# Altium schematic sheet BI2.SchDoc
size 420 x 297 mm; DocumentNumber: 7; SheetNumber: 7; SheetTotal: 13; DecimalNumber: СНАБ.468222.001 ЭЗ
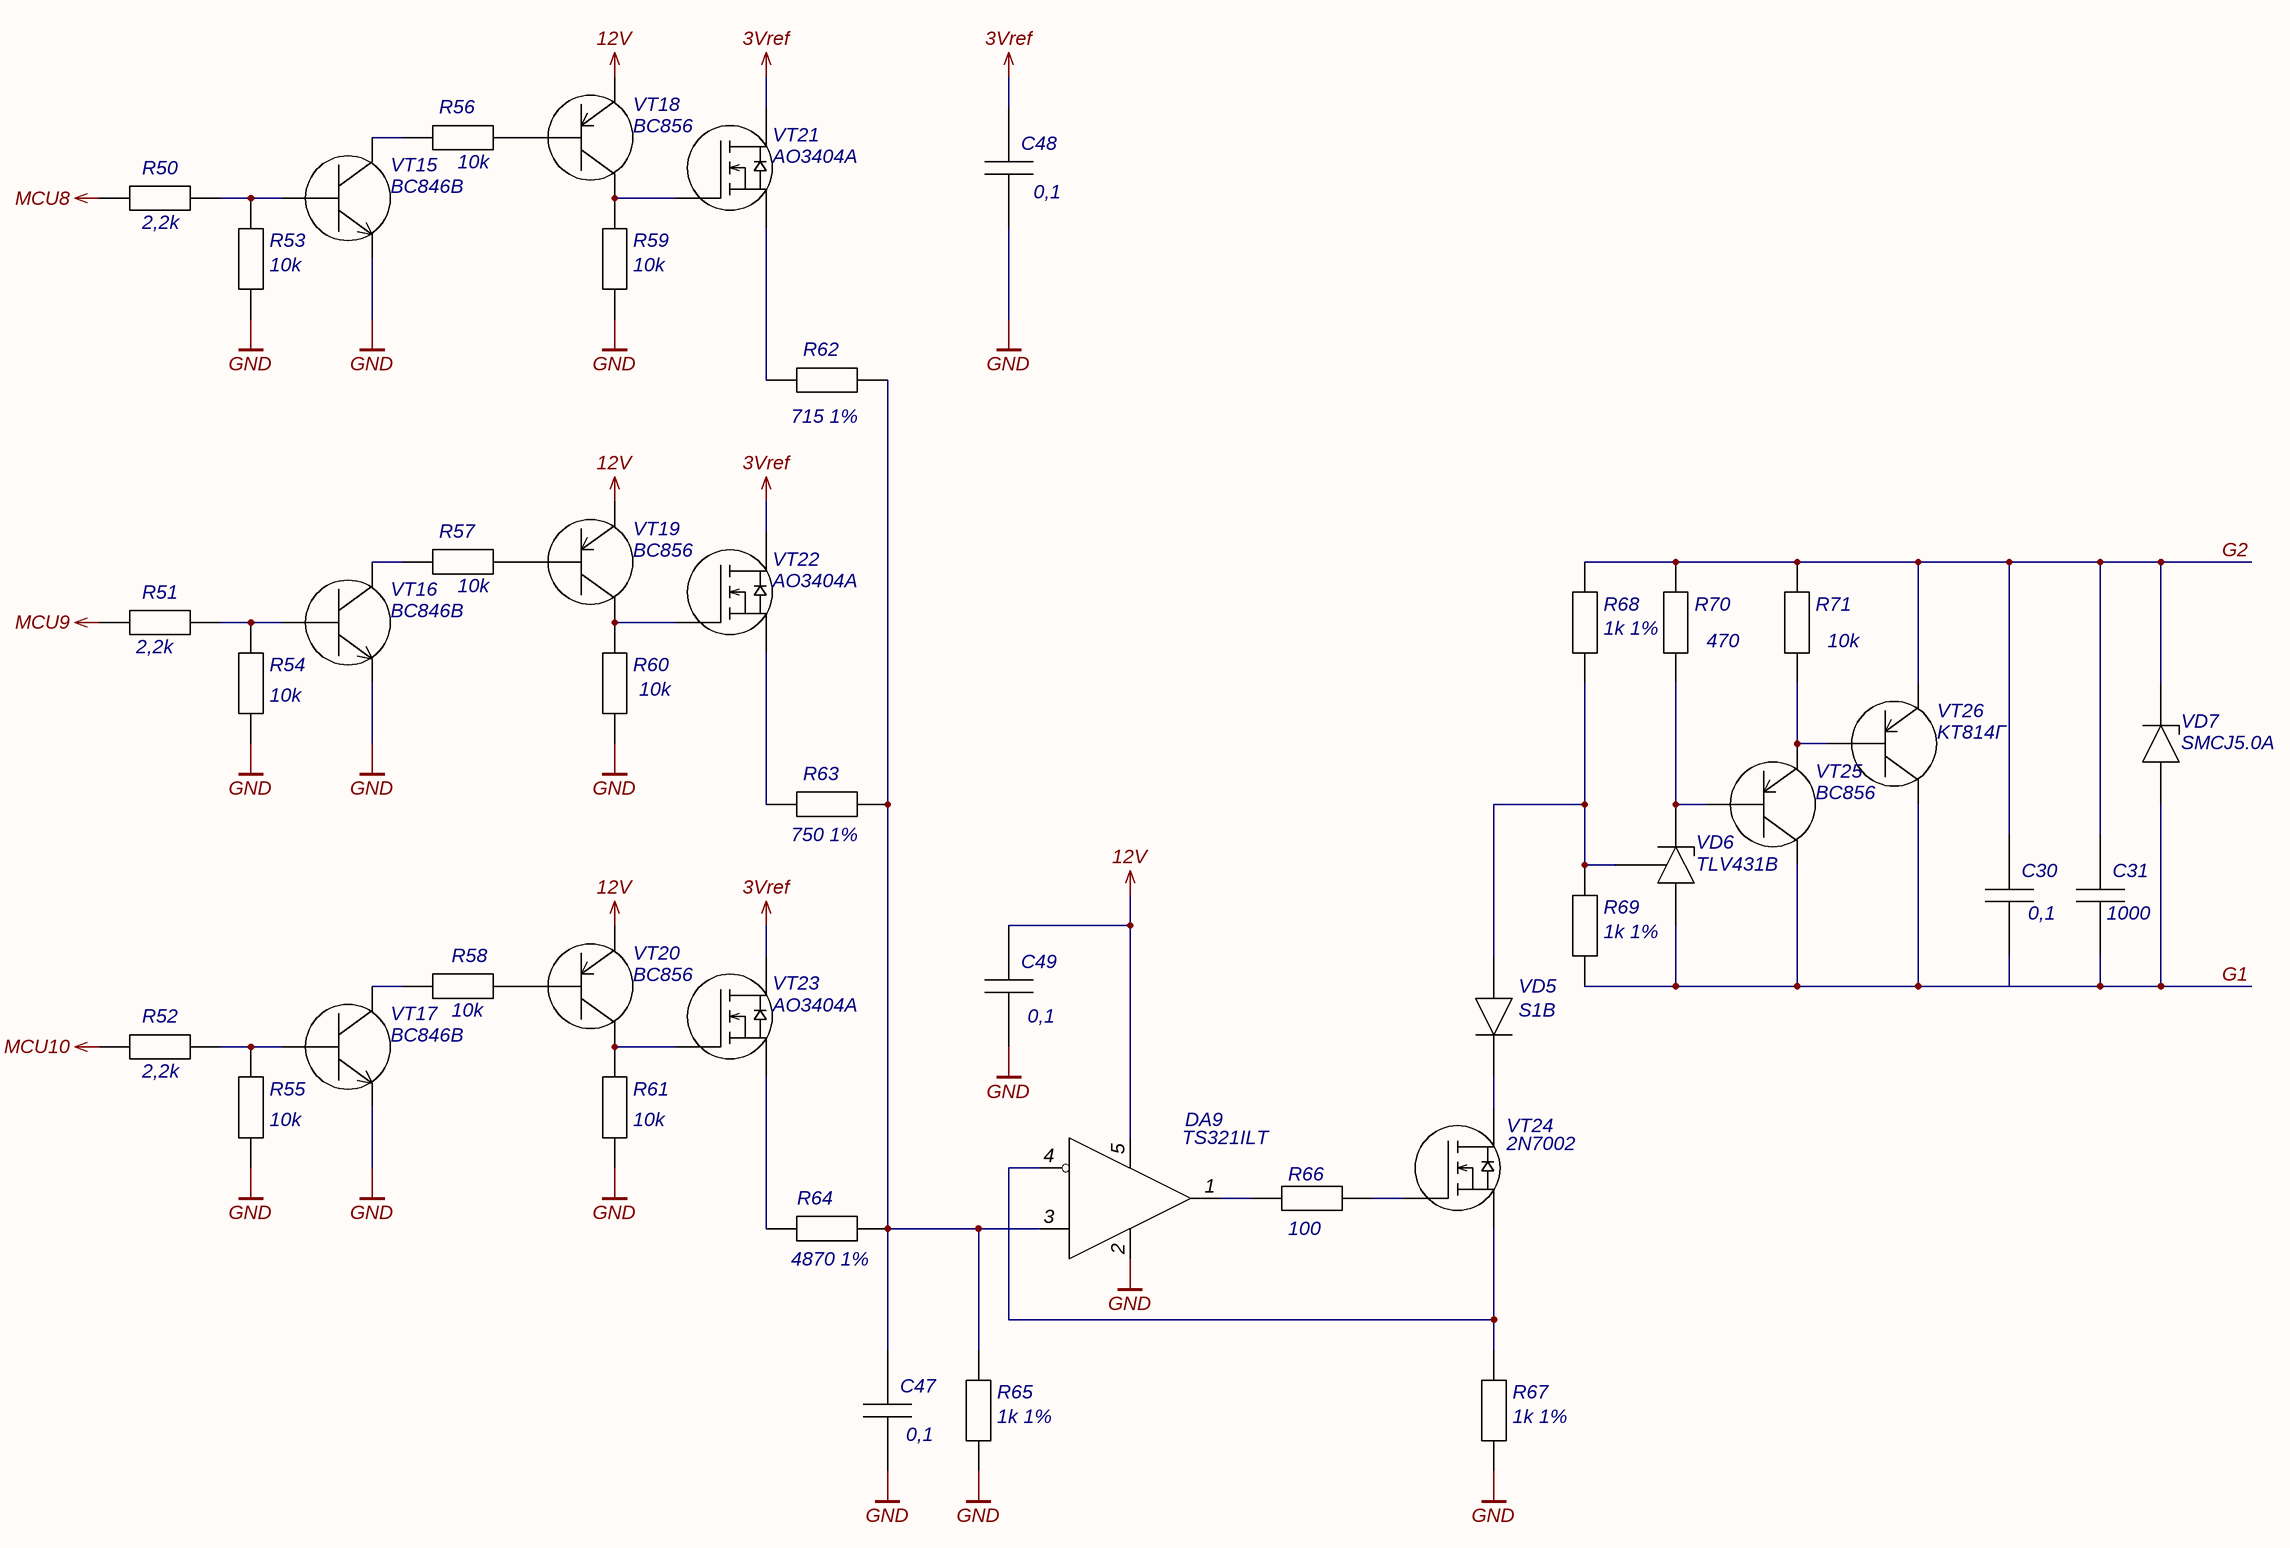
[diagram p0: BI2.SchDoc]

## Parts
C30  0,1  [C0603]
C31  1000  [C0603]
C47  0,1  [C0603]
C48  0,1  [C0603]
C49  0,1  [C0603]
DA9  TS321ILT  [SOT-23-5]
R50  2,2k  [R0603]
R51  2,2k  [R0603]
R52  2,2k  [R0603]
R53  10k  [R0603]
R54  10k  [R0603]
R55  10k  [R0603]
R56  10k  [R0603]
R57  10k  [R0603]
R58  10k  [R0603]
R59  10k  [R0603]
R60  10k  [R0603]
R61  10k  [R0603]
R62  715 1%  [R0603]
R63  750 1%  [R0603]
R64  4870 1%  [R0603]
R65  1k 1%  [R0603]
R66  100  [R0603]
R67  1k 1%  [R0603]
R68  1k 1%  [R0603]
R69  1k 1%  [R0603]
R70  470  [R0603]
R71  10k  [R0603]
VD5  S1B  [DO-214AC]
VD6  TLV431B  [SOT-23]
VD7  SMCJ5.0A  [DO-214AB]
VT15  BC846B  [SOT-23]
VT16  BC846B  [SOT-23]
VT17  BC846B  [SOT-23]
VT18  BC856  [SOT-23]
VT19  BC856  [SOT-23]
VT20  BC856  [SOT-23]
VT21  AO3404A  [SOT-23]
VT22  AO3404A  [SOT-23]
VT23  AO3404A  [SOT-23]
VT24  2N7002  [SOT-23]
VT25  BC856  [SOT-23]
VT26  KT814Г  [TO-126]

## Nets
3Vref: C48.2 VT21.2(D) VT22.2(D) VT23.2(D)
12V: C49.2 DA9.5(Vcc) VT18.1 VT19.1 VT20.1
GND: C47.1 C48.1 C49.1 DA9.2(GND) R53.1 R54.1 R55.1 R59.1 R60.1 R61.1 R65.1 R67.1 VT15.2(E) VT16.2(E) VT17.2(E)
MCU8: R50.1
MCU9: R51.1
MCU10: R52.1
G1: C30.1 C31.1 R69.1 VD6.1 VD7.1 VT25.2 VT26.2
G2: C30.2 C31.2 R68.2 R70.2 R71.2 VD7.2 VT26.1
NetC47_2: C47.2 DA9.3(+) R62.2 R63.2 R64.2 R65.2
NetDA9_1: DA9.1(OUT) R66.1
NetDA9_4: DA9.4(-) R67.2 VT24.3(S)
NetR50_2: R50.2 R53.2 VT15.1(B)
NetR51_2: R51.2 R54.2 VT16.1(B)
NetR52_2: R52.2 R55.2 VT17.1(B)
NetR56_1: R56.1 VT15.3(C)
NetR56_2: R56.2 VT18.3
NetR57_1: R57.1 VT16.3(C)
NetR57_2: R57.2 VT19.3
NetR58_1: R58.1 VT17.3(C)
NetR58_2: R58.2 VT20.3
NetR59_2: R59.2 VT18.2 VT21.1(G)
NetR60_2: R60.2 VT19.2 VT22.1(G)
NetR61_2: R61.2 VT20.2 VT23.1(G)
NetR62_1: R62.1 VT21.3(S)
NetR63_1: R63.1 VT22.3(S)
NetR64_1: R64.1 VT23.3(S)
NetR66_2: R66.2 VT24.1(G)
NetR68_1: R68.1 R69.2 VD5.1 VD6.3
NetR70_1: R70.1 VD6.2 VT25.3
NetR71_1: R71.1 VT25.1 VT26.3
NetVD5_2: VD5.2 VT24.2(D)

## Notes on the sheet
- Подп. и дата
- Инв.№ дубл.
- Взам.инв.№
- Подп.и дата
- Инв.№ подл.
- Изм.
- Лист
- № докум.
- Подп.
- Дата
- Копировал
- Формат  A3

## Library data of the parts
C30 C31 C47-C49 = Chip Capasitor: Чип-конденсатор
  C30 C47-C49: Value: 0,1
  C31: Value: 1000
DA9 = TS321ILT: 1х Операционный усилитель; Manufacurer: STMicroelectronics; Case: SOT-23-5; Name: TS321ILT; Datasheet: https://static.chipdip.ru/lib/710/DOC011710227.pdf
R50-R61 R66 R70 R71 = Chip Resistor: Чип-резистор
  R50-R52: Value: 2,2k
  R53-R61 R71: Value: 10k
  R66: Value: 100
  R70: Value: 470
R62 = Chip Resistor: Чип-резистор; Partnumber: RC0603FR-07715RL; Value: 715 1%; URL: https://www.chipdip.ru/product0/8002000768
R63 = Chip Resistor: Чип-резистор; Partnumber: RC0603FR-07750RL; Value: 750 1%; URL: https://www.chipdip.ru/product/0.1w-0603-750-om-1
R64 = Chip Resistor: Чип-резистор; Partnumber: RC0603FR-074K87L; Value: 4870 1%; URL: https://www.chipdip.ru/product0/8002000679
R65 R67-R69 = Chip Resistor: Чип-резистор; Partnumber: CRCW06031K00FKEAC; Value: 1k 1%; URL: https://www.chipdip.ru/product0/8002019285
VD5 = S1B: Диод выпрямительный, 100В; Manufacturer: Diotec Semiconductor; Case: DO-214AC; Name: S1B; Datasheet: https://static.chipdip.ru/lib/113/DOC032113174.pdf
VD6 = TLV431B: Стабилитрон регулируемый, 6В; Manufacturer: Texas Instruments; Case: SOT-23; Name: TLV431B; Datasheet: https://static.chipdip.ru/lib/985/DOC012985043.pdf
VD7 = SMCJ5.0A: Защитный диод, 5В; Manufacturer: UTD Semiconductor Co.,Ltd; Case: DO-201; Name: SMCJ5.0A; Datasheet: https://static.chipdip.ru/lib/863/DOC025863760.pdf
VT15-VT17 = BC846B: Транзистор биполярный NPN, 65В; Manufacturer: Nexperia B.V.; Case: SOT-23; Name: BC846B; Datasheet: https://static.chipdip.ru/lib/551/DOC012551042.pdf
VT18-VT20 VT25 = BC856: Транзистор биполярный PNP, 65В; Manufacturer: Nexperia; Case: SOT-23; Name: BC856; Datasheet: https://static.chipdip.ru/lib/365/DOC004365998.pdf
VT21-VT23 = AO3404A: Транзистор MOSFET N-канал, 30В; Manufacturer: UTD Semiconductor Co.,Ltd; Case: SOT-23; Name: AO3404A; Datasheet: https://static.chipdip.ru/lib/906/DOC012906979.pdf
VT24 = 2N7002: Транзистор MOSFET N-канал, 60В; Manufacturer: UTD Semiconductor Co.; Case: SOT-23; Name: 2N7002; Datasheet: https://static.chipdip.ru/lib/301/DOC021301072.pdf
VT26 = KT814Г: Транзистор биполярный PNP, 100В; Manufacturer: АО «ГРУППА КРЕМНИЙ ЭЛ»; TU: аАО.336.184 ТУ/02; Case: TO-126; Name: KT814Г; Datasheet: https://static.chipdip.ru/lib/404/DOC047404057.pdf